# EAGLE design 16bit_EPROM (EAGLE 6.5.0)
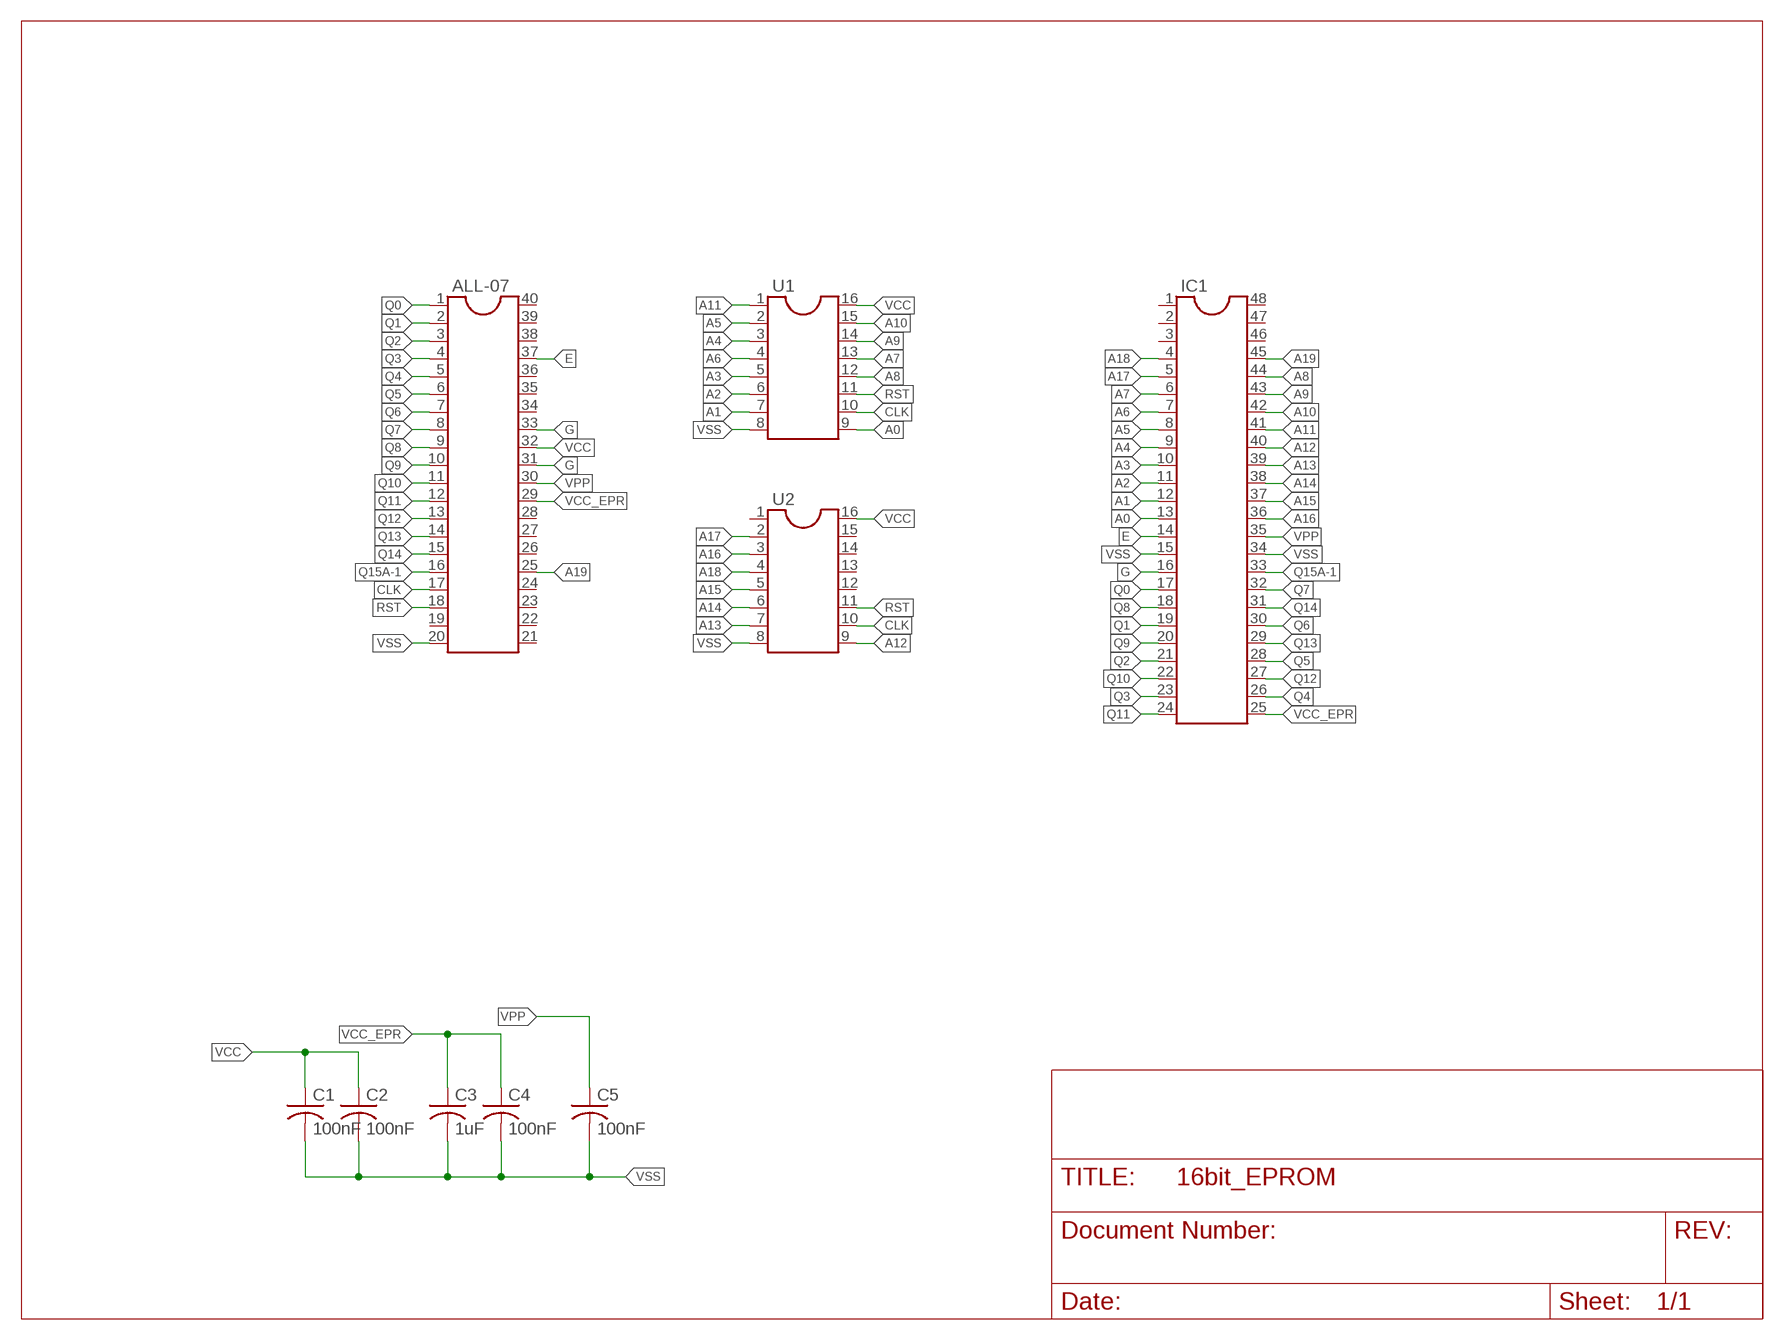
[diagram p0: schematic, sheet 1]

## Parts
ALL-07  DIL40  [DIL40]
C1  100nF  C-US050-025X075  [C050-025X075]
C2  100nF  C-US050-025X075  [C050-025X075]
C3  1uF  C-US050-025X075  [C050-025X075]
C4  100nF  C-US050-025X075  [C050-025X075]
C5  100nF  C-US050-025X075  [C050-025X075]
IC1  DIL48  [DIL48]
U1  DIL16  [DIL16]
U2  DIL16  [DIL16]

## Nets
A0: IC1.13 U1.9
A1: IC1.12 U1.7
A2: IC1.11 U1.6
A3: IC1.10 U1.5
A4: IC1.9 U1.3
A5: IC1.8 U1.2
A6: IC1.7 U1.4
A7: IC1.6 U1.13
A8: IC1.44 U1.12
A9: IC1.43 U1.14
A10: IC1.42 U1.15
A11: IC1.41 U1.1
A12: IC1.40 U2.9
A13: IC1.39 U2.7
A14: IC1.38 U2.6
A15: IC1.37 U2.5
A16: IC1.36 U2.3
A17: IC1.5 U2.2
A18: IC1.4 U2.4
A19: ALL-07.25 IC1.45
CLK: ALL-07.17 U1.10 U2.10
E: ALL-07.37 IC1.14
G: ALL-07.31 ALL-07.33 IC1.16
Q0: ALL-07.1 IC1.17
Q1: ALL-07.2 IC1.19
Q2: ALL-07.3 IC1.21
Q3: ALL-07.4 IC1.23
Q4: ALL-07.5 IC1.26
Q5: ALL-07.6 IC1.28
Q6: ALL-07.7 IC1.30
Q7: ALL-07.8 IC1.32
Q8: ALL-07.9 IC1.18
Q9: ALL-07.10 IC1.20
Q10: ALL-07.11 IC1.22
Q11: ALL-07.12 IC1.24
Q12: ALL-07.13 IC1.27
Q13: ALL-07.14 IC1.29
Q14: ALL-07.15 IC1.31
Q15A-1: ALL-07.16 IC1.33
RST: ALL-07.18 U1.11 U2.11
VCC: ALL-07.32 C1.1 C2.1 U1.16 U2.16
VCC_EPR: ALL-07.29 C3.1 C4.1 IC1.25
VPP: ALL-07.30 C5.1 IC1.35
VSS: ALL-07.20 C1.2 C2.2 C3.2 C4.2 C5.2 IC1.15 IC1.34 U1.8 U2.8
Unconnected: ALL-07.19 ALL-07.21 ALL-07.22 ALL-07.23 ALL-07.24 ALL-07.26 ALL-07.27 ALL-07.28 ALL-07.34 ALL-07.35 ALL-07.36 ALL-07.38 ALL-07.39 ALL-07.40 IC1.1 IC1.2 IC1.3 IC1.46 IC1.47 IC1.48 U2.1 U2.12 U2.13 U2.14 U2.15

## Library data of the parts
ALL-07 = ic-package:DIL40: Dual In Line
C1-C5 = rcl:C-US: CAPACITOR, American symbol
IC1 = ic-package:DIL48: Dual In Line
U1 U2 = ic-package:DIL16: Dual In Line / Socket

## Board
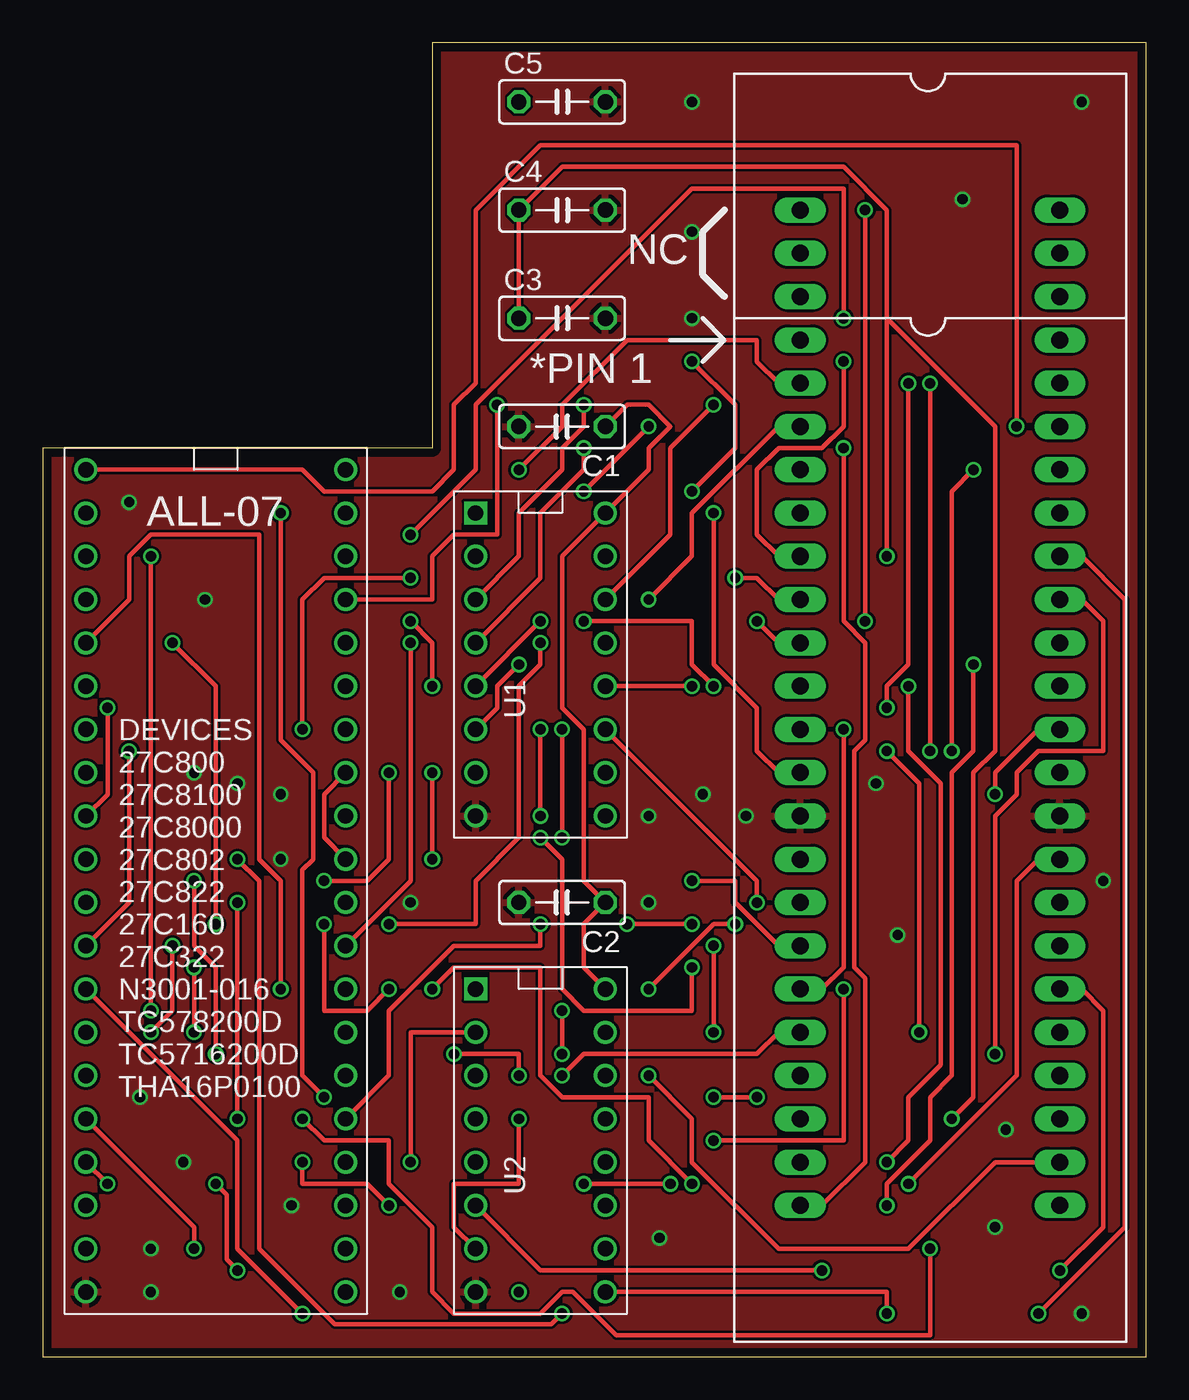
[diagram p1: board, top side]
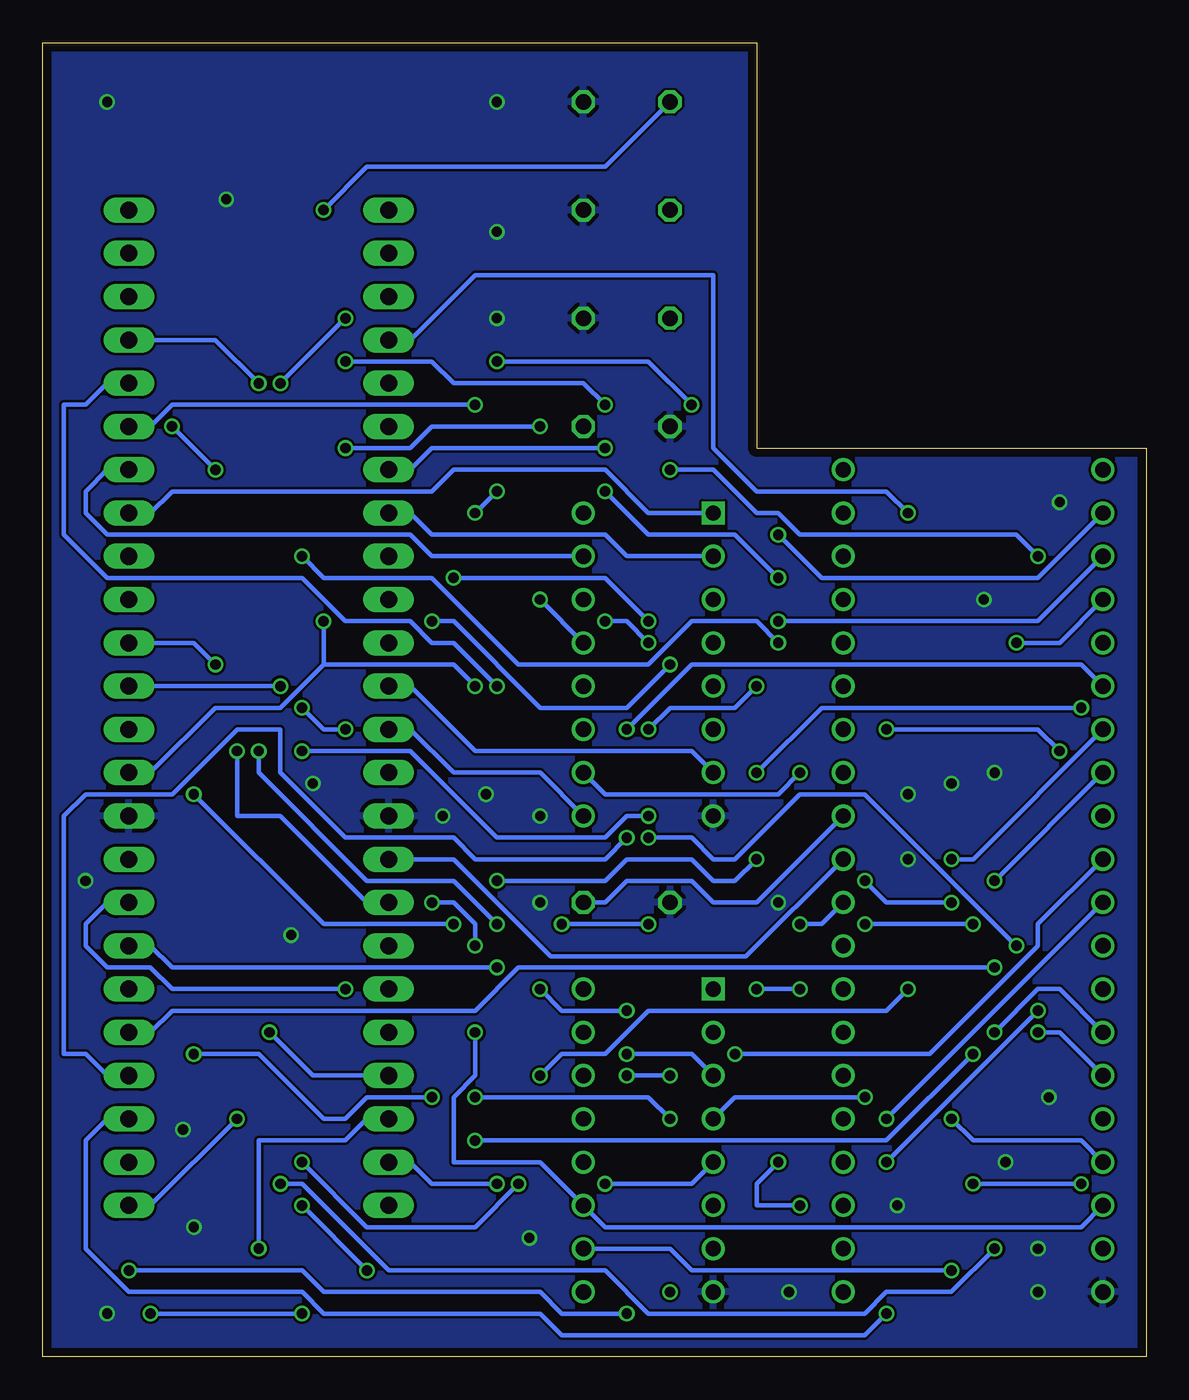
[diagram p2: board, bottom side, seen from below]

Size 64.75 x 77.14 mm. Coordinates in mm from the lower left corner, seen from the top.
Outline: 0,0 64.75,0 64.75,77.14 22.86,77.14 22.86,53.34 0,53.34 0,0
Copper layers (1*16): Top 0.035mm / dielectric 1.6mm / Bottom 0.035mm
Design rules "JLCPCB-2-layer-rule": minimum track width 5mil, minimum drill 0.2mm, track to track 6mil, track to pad 6mil, pad to pad 6mil, via to via 8mil, smd to smd 0mil, copper to edge 20mil, drill to drill 0.00508125mm, minimum pad ring 6mil, minimum via ring 6mil, stop-mask expansion 0mil, vias tented up to drill 100mil, thermal gap 10mil

### Footprints (pad centres in the part's own frame; a part is rotated, then mirrored left to right if it is on the bottom)
DIL40 = drill 0.9: 1 -24.13,-7.62; 2 -21.59,-7.62; 3 -19.05,-7.62; 4 -16.51,-7.62; 5 -13.97,-7.62; 6 -11.43,-7.62; 7 -8.89,-7.62; 8 -6.35,-7.62; 9 -3.81,-7.62; 10 -1.27,-7.62; 11 1.27,-7.62; 12 3.81,-7.62; 13 6.35,-7.62; 14 8.89,-7.62; 15 11.43,-7.62; 16 13.97,-7.62; 17 16.51,-7.62; 18 19.05,-7.62; 19 21.59,-7.62; 20 24.13,-7.62; 21 24.13,7.62; 22 21.59,7.62; 23 19.05,7.62; 24 16.51,7.62; 25 13.97,7.62; 26 11.43,7.62; 27 8.89,7.62; 28 6.35,7.62; 29 3.81,7.62; 30 1.27,7.62; 31 -1.27,7.62; 32 -3.81,7.62; 33 -6.35,7.62; 34 -8.89,7.62; 35 -11.43,7.62; 36 -13.97,7.62; 37 -16.51,7.62; 38 -19.05,7.62; 39 -21.59,7.62; 40 -24.13,7.62
C050-025X075 = drill 0.9 octagon: 1 -2.54,0; 2 2.54,0
DIL48 = drill 1 long: 1 -29.21,-7.62; 2 -26.67,-7.62; 3 -24.13,-7.62; 4 -21.59,-7.62; 5 -19.05,-7.62; 6 -16.51,-7.62; 7 -13.97,-7.62; 8 -11.43,-7.62; 9 -8.89,-7.62; 10 -6.35,-7.62; 11 -3.81,-7.62; 12 -1.27,-7.62; 13 1.27,-7.62; 14 3.81,-7.62; 15 6.35,-7.62; 16 8.89,-7.62; 17 11.43,-7.62; 18 13.97,-7.62; 19 16.51,-7.62; 20 19.05,-7.62; 21 21.59,-7.62; 22 24.13,-7.62; 23 26.67,-7.62; 24 29.21,-7.62; 25 29.21,7.62; 26 26.67,7.62; 27 24.13,7.62; 28 21.59,7.62; 29 19.05,7.62; 30 16.51,7.62; 31 13.97,7.62; 32 11.43,7.62; 33 8.89,7.62; 34 6.35,7.62; 35 3.81,7.62; 36 1.27,7.62; 37 -1.27,7.62; 38 -3.81,7.62; 39 -6.35,7.62; 40 -8.89,7.62; 41 -11.43,7.62; 42 -13.97,7.62; 43 -16.51,7.62; 44 -19.05,7.62; 45 -21.59,7.62; 46 -24.13,7.62; 47 -26.67,7.62; 48 -29.21,7.62
DIL16 = drill 0.9 square: 1 -8.89,-3.81 | drill 0.9: 2 -6.35,-3.81; 3 -3.81,-3.81; 4 -1.27,-3.81; 5 1.27,-3.81; 6 3.81,-3.81; 7 6.35,-3.81; 8 8.89,-3.81; 9 8.89,3.81; 10 6.35,3.81; 11 3.81,3.81; 12 1.27,3.81; 13 -1.27,3.81; 14 -3.81,3.81; 15 -6.35,3.81; 16 -8.89,3.81

### Placement (x,y rotation side)
ALL-07  10.16,27.94 270 top
C1  30.48,54.61 180 top
C2  30.48,26.67 180 top
C3  30.48,60.96 0 top
C4  30.48,67.31 0 top
C5  30.48,73.66 0 top
IC1  52.07,38.1 270 top
U1  29.21,40.64 270 top
U2  29.21,12.7 270 top

### Tracks (layer width: path | path; a pad name or v marks a point on that pad's centre or on a via)
A0
  Bottom 0.254: U1.9 35.56,34.29 40.64,34.29 43.18,36.83 IC1.13
A1
  Bottom 0.254: U1.7 26.67,35.56 39.37,35.56 43.18,39.37 IC1.12
A2  (via drill 0.61)
  Top 0.254: U1.6 26.67,38.1 26.67,39.37 v27.94,40.64 | v41.91,43.18 43.18,41.91 IC1.11
  Bottom 0.254: v27.94,40.64 30.48,38.1 35.56,38.1 40.64,43.18 v41.91,43.18
A3  (via drill 0.61)
  Top 0.254: v29.21,43.18 U1.5 | v40.64,45.72 41.91,45.72 43.18,44.45 IC1.10
  Bottom 0.254: v29.21,43.18 31.75,45.72 v40.64,45.72
A4  (via drill 0.61)
  Top 0.254: U1.3 27.94,46.99 27.94,49.53 30.48,52.07 30.48,53.34 31.75,54.61 v31.75,55.88 | v46.99,58.42 46.99,54.61 45.72,53.34 43.18,53.34 41.91,52.07 41.91,48.26 43.18,46.99 IC1.9
  Bottom 0.254: v31.75,55.88 33.02,57.15 40.64,57.15 41.91,58.42 v46.99,58.42
A5
  Bottom 0.254: U1.2 30.48,46.99 31.75,48.26 41.91,48.26 43.18,49.53 IC1.8
A6  (via drill 0.61)
  Top 0.254: U1.4 29.21,45.72 29.21,49.53 31.75,52.07 v31.75,53.34
  Bottom 0.254: v31.75,53.34 41.91,53.34 43.18,52.07 IC1.7
A7  (via drill 0.61)
  Top 0.254: v35.56,44.45 38.1,46.99 38.1,49.53 43.18,54.61 IC1.6
  Bottom 0.254: v35.56,44.45 U1.13
A8  (via drill 0.61)
  Top 0.254: v38.1,39.37 U1.12
  Bottom 0.254: v38.1,39.37 40.64,41.91 41.91,41.91 43.18,43.18 46.99,43.18 49.53,45.72 60.96,45.72 63.5,48.26 63.5,55.88 62.23,55.88 60.96,57.15 IC1.44
A9  (via drill 0.61)
  Top 0.254: U1.14 36.83,48.26 36.83,53.34 v39.37,55.88
  Bottom 0.254: v39.37,55.88 57.15,55.88 58.42,54.61 IC1.43
A10
  Bottom 0.254: U1.15 41.91,46.99 43.18,48.26 60.96,48.26 62.23,49.53 62.23,50.8 60.96,52.07 IC1.42
A11
  Bottom 0.254: U1.1 29.21,49.53 31.75,52.07 40.64,52.07 41.91,50.8 57.15,50.8 58.42,49.53 IC1.41
A12  (via drill 0.61)
  Top 0.254: U2.9 49.53,3.81 v49.53,2.54 | v58.42,2.54 63.5,7.62 63.5,44.45 60.96,46.99 IC1.40
  Bottom 0.254: v58.42,2.54 v49.53,2.54
A13  (via drill 0.61)
  Top 0.254: U2.7 24.13,7.62 24.13,10.16 27.94,10.16 v27.94,13.97 | v41.91,15.24 v39.37,15.24 | v55.88,17.78 55.88,31.75 57.15,33.02 57.15,34.29 58.42,35.56 62.23,35.56 62.23,43.18 60.96,44.45 IC1.39
  Bottom 0.254: v27.94,13.97 29.21,15.24 v39.37,15.24 | v41.91,15.24 45.72,15.24 46.99,13.97 48.26,13.97 52.07,17.78 v55.88,17.78
A14  (via drill 0.61)
  Top 0.254: U2.6 29.21,5.08 v45.72,5.08 | v49.53,8.89 49.53,10.16 52.07,12.7 52.07,15.24 53.34,16.51 53.34,34.29 54.61,35.56 v54.61,40.64
  Bottom 0.254: v49.53,8.89 v45.72,5.08 | v54.61,40.64 55.88,41.91 IC1.38
A15  (via drill 0.61)
  Top 0.254: v36.83,10.16 v31.75,10.16 | v49.53,11.43 50.8,12.7 50.8,15.24 52.71,17.14 52.71,33.66 50.8,35.56 v50.8,39.37
  Bottom 0.254: U2.5 26.67,10.16 v31.75,10.16 | v36.83,10.16 39.37,7.62 45.72,7.62 v49.53,11.43 | IC1.37 v50.8,39.37
A16  (via drill 0.61)
  Top 0.254: v30.48,20.32 v30.48,17.78 | v35.56,21.59 39.37,25.4 v40.64,25.4 | v55.88,33.02 55.88,34.29 58.42,36.83 IC1.36
  Bottom 0.254: U2.3 26.67,17.78 v30.48,17.78 | v30.48,20.32 34.29,20.32 v35.56,21.59 | v40.64,25.4 48.26,25.4 v55.88,33.02
A17  (via drill 0.61)
  Top 0.254: U2.2 21.59,19.05 v21.59,11.43 | v20.32,8.89 19.05,10.16 15.24,10.16 v15.24,11.43 | v6.35,46.99 v6.35,20.32 | v27.94,52.07 30.48,54.61 30.48,55.88 34.29,59.69 41.91,59.69 41.91,58.42 43.18,57.15 IC1.5
  Bottom 0.254: v21.59,11.43 22.86,10.16 22.86,8.89 v20.32,8.89 | v6.35,20.32 v15.24,11.43 | v6.35,46.99 7.62,48.26 20.32,48.26 21.59,49.53 22.86,49.53 25.4,52.07 v27.94,52.07
A18  (via drill 0.61)
  Top 0.254: v13.97,49.53 13.97,36.2 15.88,34.29 15.88,29.21 15.24,28.57 15.24,16.51 v16.51,15.24
  Bottom 0.254: U2.4 24.13,15.24 v16.51,15.24 | v13.97,49.53 15.24,50.8 22.86,50.8 25.4,53.34 25.4,63.5 39.37,63.5 43.18,59.69 IC1.4
A19  (via drill 0.61)
  Top 0.254: ALL-07.25 20.32,16.51 20.32,20.32 24.13,24.13 29.21,24.13 v29.21,25.4 | v38.1,25.4 v34.29,25.4 | v52.07,57.15 v52.07,35.56
  Bottom 0.254: v34.29,25.4 v29.21,25.4 | v38.1,25.4 40.64,27.94 45.72,27.94 52.07,34.29 v52.07,35.56 | v52.07,57.15 54.61,59.69 IC1.45
CLK  (via drill 0.6, 0.61)
  Top 0.254: v20.32,34.29 20.32,29.21 19.05,27.94 v16.51,27.94 | v11.43,13.97 v11.43,26.67 | ALL-07.17 v3.81,10.16 | v10.16,10.16 10.79,9.53 10.79,5.71 v11.43,5.08
  Bottom 0.254: U2.10 27.94,6.35 26.67,5.08 v11.43,5.08 | U1.10 31.75,33.02 21.59,33.02 v20.32,34.29 | v16.51,27.94 15.24,26.67 v11.43,26.67 | v11.43,13.97 10.16,12.7 3.81,12.7 ALL-07.17 | v3.81,10.16 v10.16,10.16
E  (via drill 0.61)
  Top 0.254: ALL-07.37 22.86,44.45 22.86,46.99 24.13,48.26 26.67,48.26 v26.67,55.88 | v38.1,58.42 40.64,55.88 40.64,53.34 v38.1,50.8 | v39.37,49.53 39.37,40.64 41.91,38.1 41.91,35.56 43.18,34.29 IC1.14
  Bottom 0.254: v26.67,55.88 29.21,58.42 v38.1,58.42 | v39.37,49.53 v38.1,50.8
G
  Top 0.254: ALL-07.31 16.51,30.48 16.51,33.02 ALL-07.33
  Bottom 0.254: IC1.16 40.64,29.21 34.93,23.49 23.5,23.49 ALL-07.31
N$7  (via drill 0.6)
  other vias: 27.94,3.81
Q0  (via drill 0.61)
  Top 0.254: ALL-07.1 15.24,52.07 16.51,50.8 22.86,50.8 24.13,52.07 24.13,55.88 25.4,57.15 25.4,67.31 29.21,71.12 57.15,71.12 v57.15,54.61 | v54.61,52.07 53.34,50.8 v53.34,35.56
  Bottom 0.254: v54.61,52.07 v57.15,54.61 | v53.34,35.56 53.34,31.75 50.8,31.75 45.72,26.67 IC1.17
Q1  (via drill 0.61)
  Top 0.254: v21.59,48.26 25.4,52.07 25.4,55.88 38.1,68.58 46.99,68.58 v46.99,60.96 | v50.8,57.15 50.8,40.64 49.53,39.37 v49.53,38.1 | v46.99,36.83 46.99,22.86 45.72,21.59 IC1.19
  Bottom 0.254: ALL-07.2 6.35,45.72 19.05,45.72 v21.59,48.26 | v50.8,57.15 v46.99,60.96 | v49.53,38.1 48.26,36.83 v46.99,36.83
Q2  (via drill 0.61)
  Top 0.254: v21.59,43.18 22.86,41.91 v22.86,39.37 | v29.21,31.75 v29.21,36.83 | v51.44,19.05 51.44,33.66 v49.53,35.56
  Bottom 0.254: ALL-07.3 6.35,43.18 v21.59,43.18 | v22.86,39.37 24.13,38.1 27.94,38.1 v29.21,36.83 | v29.21,31.75 30.48,31.75 31.75,30.48 38.1,30.48 43.18,35.56 v49.53,35.56 | IC1.21 48.9,16.51 v51.44,19.05
Q3  (via drill 0.61)
  Top 0.254: v7.62,41.91 10.16,39.37 v10.16,25.4 | v22.86,21.59 24.13,22.86 29.21,22.86 29.21,16.51 30.48,15.24 35.56,15.24 35.56,12.7 v38.1,10.16 | v16.51,25.4 16.51,20.32 19.05,20.32 v20.32,21.59
  Bottom 0.254: ALL-07.4 5.08,41.91 v7.62,41.91 | v16.51,25.4 v10.16,25.4 | v22.86,21.59 v20.32,21.59 | v38.1,10.16 41.91,10.16 43.18,11.43 IC1.23
Q4  (via drill 0.61)
  Top 0.254: ALL-07.5 5.08,44.45 5.08,46.99 6.35,48.26 12.7,48.26 12.7,29.21 13.97,27.94 v13.97,21.59 | v35.56,16.51 38.1,13.97 38.1,11.43 43.18,6.35 50.8,6.35 55.88,11.43 IC1.26
  Bottom 0.254: v13.97,21.59 15.24,20.32 29.21,20.32 31.75,17.78 34.29,17.78 v35.56,16.51
Q5  (via drill 0.61)
  Top 0.254: v30.48,30.48 v30.48,36.83
  Bottom 0.254: ALL-07.6 3.81,40.64 26.67,40.64 v30.48,36.83 | v30.48,30.48 31.75,29.21 39.37,29.21 40.64,30.48 46.99,30.48 50.8,34.29 50.8,36.83 53.34,36.83 57.15,33.02 62.23,33.02 63.5,31.75 63.5,17.78 62.23,17.78 60.96,16.51 IC1.28
Q6  (via drill 0.61)
  Top 0.254: v11.43,29.21 12.7,27.94 12.7,6.35 17.14,1.91 29.84,1.91 v30.48,2.54 | v59.69,5.08 62.23,7.62 62.23,20.32 60.96,21.59 IC1.30
  Bottom 0.254: ALL-07.7 10.16,29.21 v11.43,29.21 | v30.48,2.54 34.29,2.54 35.56,3.81 48.26,3.81 49.53,5.08 v59.69,5.08
Q7  (via drill 0.61)
  Top 0.254: v8.89,27.94 8.89,24.13 10.16,22.86 v10.16,17.78 | v39.37,12.7 46.99,12.7 v46.99,21.59
  Bottom 0.254: v8.89,27.94 ALL-07.8 | v10.16,17.78 15.24,12.7 v39.37,12.7 | v46.99,21.59 57.15,21.59 58.42,22.86 60.96,22.86 62.23,24.13 62.23,25.4 60.96,26.67 IC1.32
Q8  (via drill 0.61)
  Top 0.254: ALL-07.9 3.81,33.02 v3.81,38.1 | v22.86,29.21 v22.86,34.29 | v38.1,27.94 40.64,27.94 40.64,26.67 43.18,24.13 IC1.18
  Bottom 0.254: v3.81,38.1 19.05,38.1 v22.86,34.29 | v22.86,29.21 24.13,27.94 25.4,27.94 26.67,29.21 30.48,29.21 31.75,27.94 v38.1,27.94
Q9  (via drill 0.61)
  Top 0.254: v24.13,17.78 27.94,17.78 v27.94,16.51 | v30.48,16.51 31.75,17.78 41.91,17.78 43.18,19.05 IC1.20
  Bottom 0.254: ALL-07.10 6.35,25.4 6.35,24.13 12.7,17.78 v24.13,17.78 | v30.48,16.51 v27.94,16.51
Q10  (via drill 0.61)
  Top 0.254: v15.24,13.97 16.51,12.7 20.32,12.7 20.32,10.16 22.86,7.62 22.86,3.81 24.13,2.54 29.21,2.54 30.48,3.81 31.11,3.81 33.66,1.27 52.07,1.27 v52.07,6.35
  Bottom 0.254: v15.24,13.97 ALL-07.11 | v52.07,6.35 52.07,12.7 46.99,12.7 45.72,13.97 IC1.22
Q11  (via drill 0.61)
  Top 0.254: ALL-07.12 5.08,26.67 v5.08,35.56 | v15.24,36.83 15.24,44.45 16.51,45.72 v21.59,45.72 | v35.56,54.61 v31.75,50.8 | v46.99,53.34 46.99,43.18 48.26,41.91 48.26,36.2 47.62,35.56 47.62,22.86 48.26,22.22 48.26,11.43 45.72,8.89 IC1.24
  Bottom 0.254: v5.08,35.56 6.35,36.83 v15.24,36.83 | v21.59,45.72 24.13,48.26 29.21,48.26 v31.75,50.8 | v35.56,54.61 41.91,54.61 43.18,53.34 v46.99,53.34
Q12  (via drill 0.61)
  Top 0.254: ALL-07.13 11.43,12.7 11.43,6.35 v15.24,2.54
  Bottom 0.254: v15.24,2.54 16.51,1.27 34.29,1.27 35.56,2.54 48.26,2.54 49.53,3.81 59.69,3.81 62.23,6.35 62.23,12.7 60.96,13.97 IC1.27
Q13  (via drill 0.61)
  Top 0.254: v8.89,22.86 v8.89,19.05
  Bottom 0.254: ALL-07.14 5.08,21.59 6.35,21.59 v8.89,19.05 | v8.89,22.86 36.83,22.86 39.37,20.32 57.15,20.32 58.42,19.05 IC1.29
Q14  (via drill 0.61)
  Top 0.254: v6.35,19.05 7.62,20.32 v7.62,24.13 | v29.21,30.48 30.48,29.21 30.48,21.59 31.75,20.32 38.1,20.32 v38.1,22.86
  Bottom 0.254: ALL-07.15 5.08,19.05 v6.35,19.05 | v7.62,24.13 16.51,33.02 20.32,33.02 24.13,29.21 25.4,29.21 26.67,30.48 v29.21,30.48 | v38.1,22.86 57.15,22.86 58.42,24.13 IC1.31
Q15A-1  (via drill 0.61)
  Top 0.254: ALL-07.16 8.89,7.62 v8.89,6.35 | v50.8,10.16 57.15,16.51 57.15,27.94 58.42,29.21 IC1.33
  Bottom 0.254: v8.89,6.35 11.43,3.81 15.24,3.81 16.51,2.54 29.21,2.54 31.75,5.08 44.45,5.08 49.53,10.16 v50.8,10.16
RST  (via drill 0.61)
  Top 0.254: U1.11 41.91,27.94 v41.91,26.67 | v39.37,19.05 v39.37,24.13
  Bottom 0.254: ALL-07.18 3.81,7.62 31.75,7.62 U2.11 35.56,11.43 40.64,11.43 40.64,15.24 39.37,16.51 v39.37,19.05 | v41.91,26.67 40.64,26.67 39.37,25.4 v39.37,24.13
VCC
  Top 0.254: C1.1 34.29,55.88 35.56,55.88 36.83,54.61 35.56,53.34 35.56,52.07 U1.16 30.48,46.99 30.48,38.1 31.75,36.83 31.75,27.94 C2.1 31.75,25.4 31.75,22.86 U2.16
  Bottom 0.254: ALL-07.32 22.86,26.67 25.4,26.67 26.67,27.94 30.48,27.94 31.75,26.67 C2.1
VCC_EPR  (via drill 0.61)
  Top 0.254: ALL-07.29 21.59,27.94 v21.59,41.91 | 49.53,60.96 49.53,67.31 46.99,69.85 30.48,69.85 C4.1 C3.1 | 49.53,60.96 v49.53,46.99 | v53.34,13.97 54.61,15.24 54.61,34.29 55.88,35.56 55.88,54.61 49.53,60.96
  Bottom 0.254: v21.59,41.91 22.86,43.18 26.67,43.18 29.21,40.64 36.83,40.64 41.91,45.72 48.26,45.72 v49.53,46.99 | IC1.25 58.42,8.89 v53.34,13.97
VPP  (via drill 0.61)
  Top 0.254: v20.32,25.4 25.4,25.4 25.4,27.94 27.94,30.48 27.94,39.37 29.21,40.64 v29.21,41.91 | v31.75,43.18 38.1,43.18 38.1,40.64 v39.37,39.37 | v48.26,43.18 v48.26,67.31
  Bottom 0.254: ALL-07.30 19.05,25.4 v20.32,25.4 | v29.21,41.91 30.48,43.18 v31.75,43.18 | v39.37,39.37 40.64,40.64 48.26,40.64 | 48.26,40.64 50.8,38.1 54.61,38.1 58.42,34.29 IC1.35 | C5.1 31.75,69.85 45.72,69.85 v48.26,67.31 | 48.26,40.64 v48.26,43.18
VSS  (via drill 0.6)
  other vias: 38.1,66.04 38.1,60.96 38.1,73.66 60.96,73.66 62.23,27.94 55.88,7.62 56.52,13.34 41.28,31.75 21.59,26.67 6.35,3.81 6.35,6.35 20.95,3.81 8.26,11.43 14.61,8.89 13.97,29.21 13.97,33.02 8.89,34.29 11.43,33.66 35.56,26.67 35.56,31.75 38.74,33.02 48.9,33.66 50.17,24.77 53.98,67.95 5.08,50.16 9.53,44.45 5.71,15.24 36.2,6.99 60.96,2.54
  pour Top: 0,0 0,53.34 22.86,53.34 22.86,77.47 64.77,77.47 64.77,0
  pour Bottom: 0,0 0,53.34 22.86,53.34 22.86,77.47 64.77,77.47 64.77,0

### Text on the board
tPlace: NC | *PIN 1 | DEVICES / 27C800 / 27C8100 / 27C8000 / 27C802 / 27C822 / 27C160 / 27C322 / N3001-016 / TC578200D / TC5716200D / THA16P0100